# Altium schematic sheet SH6 - PCIe ETHERNET.SchDoc: Jetson AGX Xavier Carrier Board - Ethernet
size B; Engineer: Cindy Li, Chealsie Bains; Organization: UW Robotics; Address1: 200 University Avenue; Address2: Waterloo; Address3: Ontario; Address4: Canada N2L 3G6; DocumentNumber: 6; Revision: 1; SheetNumber: 6; SheetTotal: 12
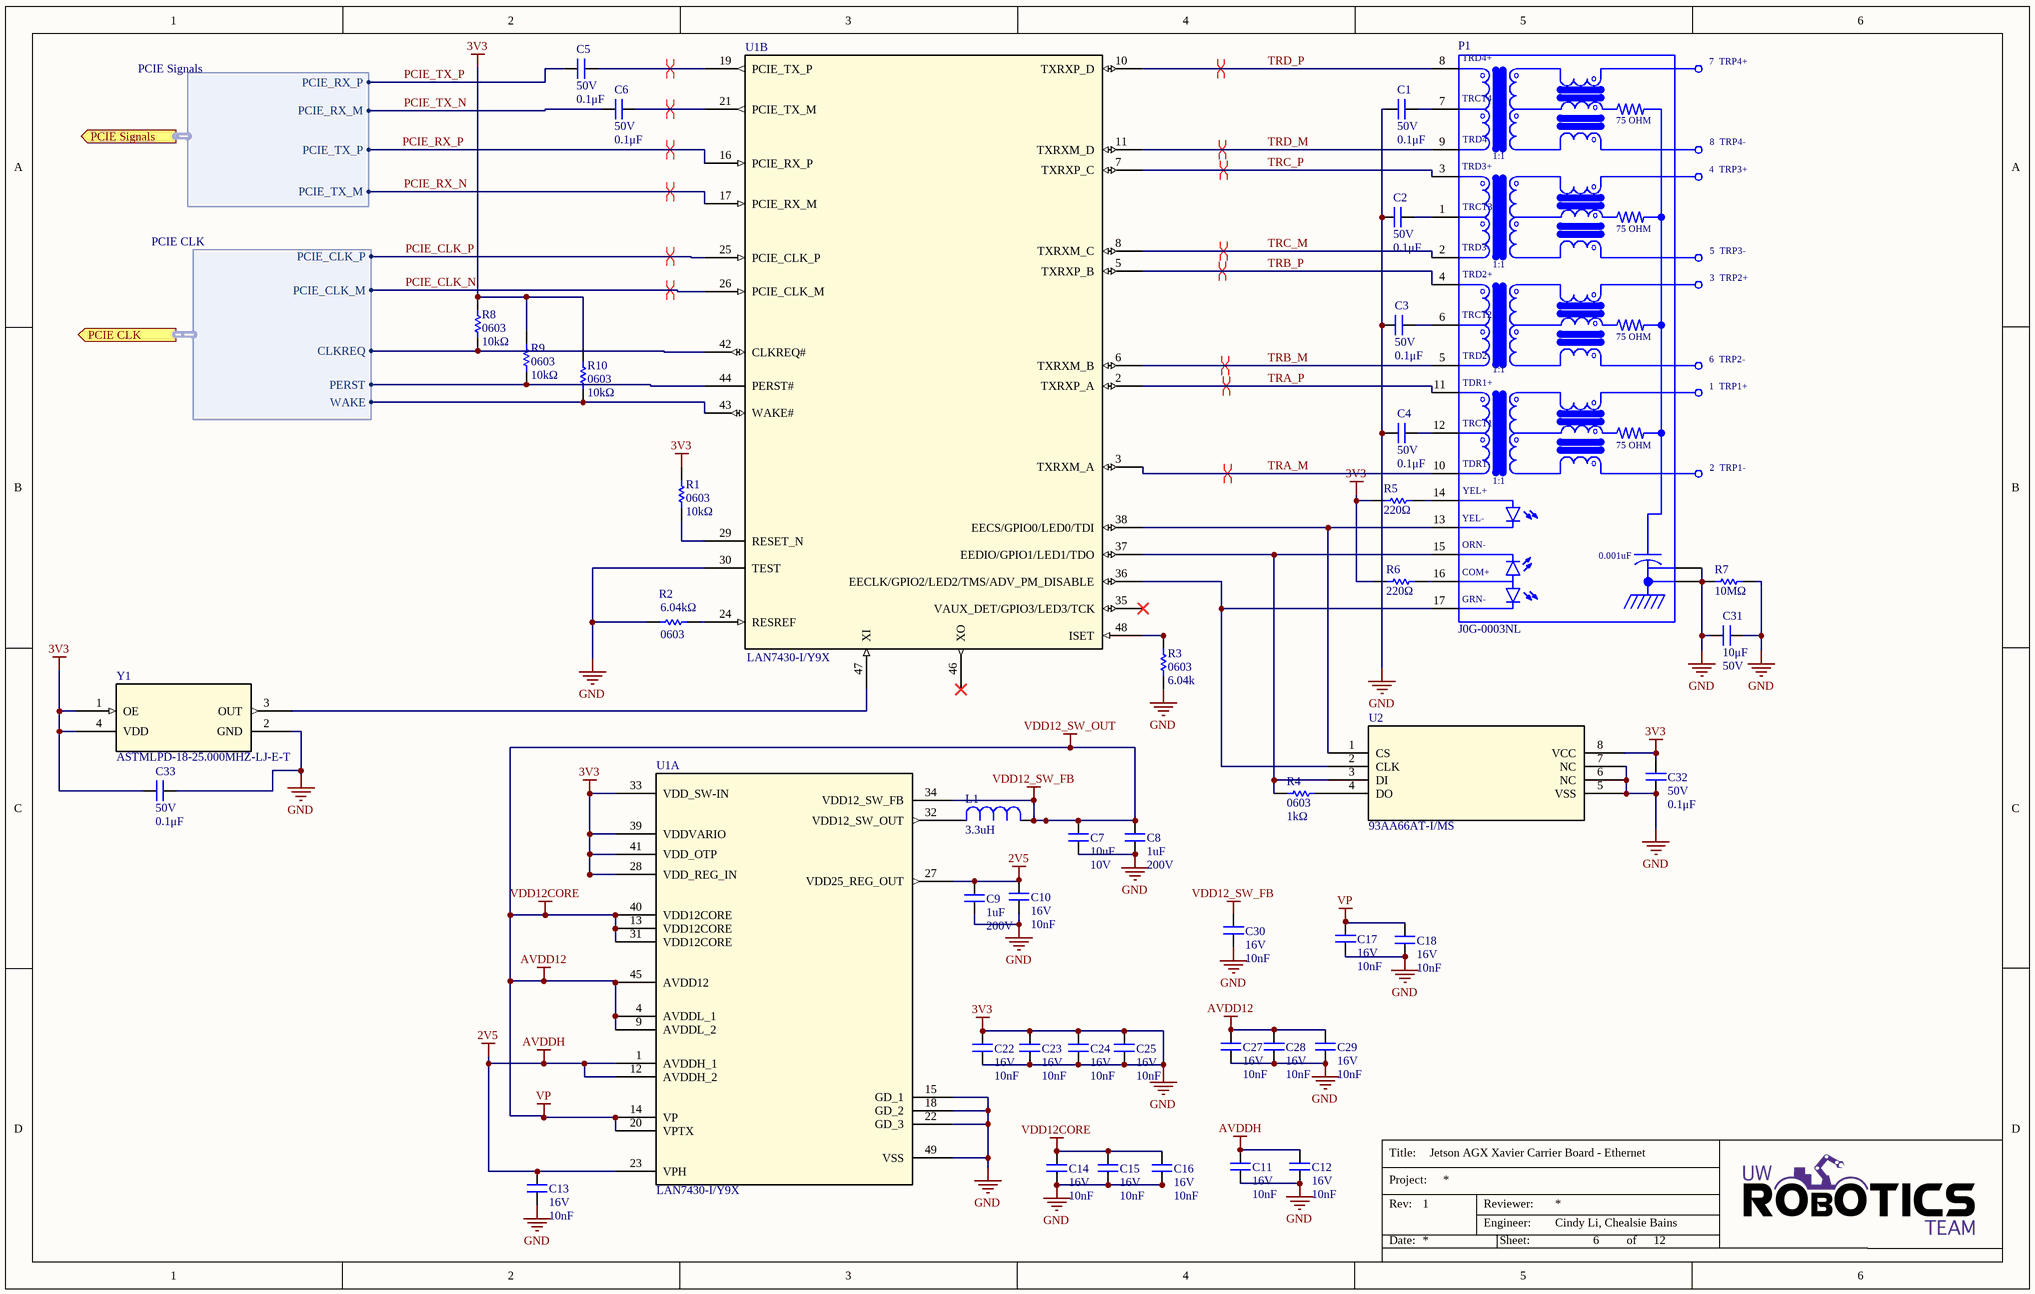
[diagram p0: SH6 - PCIe ETHERNET.SchDoc]

## Parts
C1  value 0.1μF  Voltage Rating: 50V  [CAP0603]  (hidden comment: CAP_0.1uF_50V_0603)
C2  value 0.1μF  Voltage Rating: 50V  [CAP0603]  (hidden comment: CAP_0.1uF_50V_0603)
C3  value 0.1μF  Voltage Rating: 50V  [CAP0603]  (hidden comment: CAP_0.1uF_50V_0603)
C4  value 0.1μF  Voltage Rating: 50V  [CAP0603]  (hidden comment: CAP_0.1uF_50V_0603)
C5  value 0.1μF  Voltage Rating: 50V  [CAP0603]  (hidden comment: CAP_0.1uF_50V_0603)
C6  value 0.1μF  Voltage Rating: 50V  [CAP0603]  (hidden comment: CAP_0.1uF_50V_0603)
C7  value 10uF  Voltage: 10V  (hidden comment: CAP CER 10UF 10V X6S 0805)
C8  value 1uF  Voltage Rating: 200V  [CAP_CER_10000PF]  (hidden comment: CAP_1uF_200V_0603)
C9  value 1uF  Voltage Rating: 200V  [CAP_CER_10000PF]  (hidden comment: CAP_1uF_200V_0603)
C10  value 10nF  Voltage Rating: 16V  [CAP2012]  (hidden comment: CAP_10nF_16V_0805)
C11  value 10nF  Voltage Rating: 16V  [CAP2012]  (hidden comment: CAP_10nF_16V_0805)
C12  value 10nF  Voltage Rating: 16V  [CAP2012]  (hidden comment: CAP_10nF_16V_0805)
C13  value 10nF  Voltage Rating: 16V  [CAP2012]  (hidden comment: CAP_10nF_16V_0805)
C14  value 10nF  Voltage Rating: 16V  [CAP2012]  (hidden comment: CAP_10nF_16V_0805)
C15  value 10nF  Voltage Rating: 16V  [CAP2012]  (hidden comment: CAP_10nF_16V_0805)
C16  value 10nF  Voltage Rating: 16V  [CAP2012]  (hidden comment: CAP_10nF_16V_0805)
C17  value 10nF  Voltage Rating: 16V  [CAP2012]  (hidden comment: CAP_10nF_16V_0805)
C18  value 10nF  Voltage Rating: 16V  [CAP2012]  (hidden comment: CAP_10nF_16V_0805)
C22  value 10nF  Voltage Rating: 16V  [CAP2012]  (hidden comment: CAP_10nF_16V_0805)
C23  value 10nF  Voltage Rating: 16V  [CAP2012]  (hidden comment: CAP_10nF_16V_0805)
C24  value 10nF  Voltage Rating: 16V  [CAP2012]  (hidden comment: CAP_10nF_16V_0805)
C25  value 10nF  Voltage Rating: 16V  [CAP2012]  (hidden comment: CAP_10nF_16V_0805)
C27  value 10nF  Voltage Rating: 16V  [CAP2012]  (hidden comment: CAP_10nF_16V_0805)
C28  value 10nF  Voltage Rating: 16V  [CAP2012]  (hidden comment: CAP_10nF_16V_0805)
C29  value 10nF  Voltage Rating: 16V  [CAP2012]  (hidden comment: CAP_10nF_16V_0805)
C30  value 10nF  Voltage Rating: 16V  [CAP2012]  (hidden comment: CAP_10nF_16V_0805)
C31  value 10μF  Voltage Rating: 50V  [CAP1206]  (hidden comment: CAP_10uF_50V_1206)
C32  value 0.1μF  Voltage Rating: 50V  [CAP0603]  (hidden comment: CAP_0.1uF_50V_0603)
C33  value 0.1μF  Voltage Rating: 50V  [CAP0603]  (hidden comment: CAP_0.1uF_50V_0603)
L1  Inductance: 3.3uH  [IND_BOURNS_SRN6045]  (hidden comment: IND_3.3uH)
P1  J0G-0003NL  [PULSE_J0G-0003NL]
R1  value 10kΩ  Package/Footprint: 0603  [RESC0603]  (hidden comment: RES_10kΩ_0603_5%)
R2  (no value)  [RESC1608X55N]
R3  value 6.04k  Package/Footprint: 0603  [RES0603]  (hidden comment: RES_6.04kΩ_0603_1%)
R4  value 1kΩ  Package/Footprint: 0603  [RESC0603]  (hidden comment: RES_1kΩ_0603_5%)
R5  value 220Ω  [RESC0603]  (hidden comment: RES_220Ω_0603)
R6  value 220Ω  [RESC0603]  (hidden comment: RES_220Ω_0603)
R7  value 10MΩ  [RES0603]  (hidden comment: RES_10MΩ_0603)
R8  value 10kΩ  Package/Footprint: 0603  [RES0603]  (hidden comment: RES_10kΩ_0603_5%)
R9  value 10kΩ  Package/Footprint: 0603  [RES0603]  (hidden comment: RES_10kΩ_0603_5%)
R10  value 10kΩ  Package/Footprint: 0603  [RES0603]  (hidden comment: RES_10kΩ_0603_5%)
U1  LAN7430-I/Y9X  [SQFN48_MCH]  (parts A,B of 2)
U2  93AA66AT-I/MS  [MSOP8_MC_MCH]
Y1  ASTMLPD-18-25.000MHZ-LJ-E-T  [ASTMLPE_ABR]

## Ports
PCIE CLK (out, harness PCIE CLK), PCIE Signals (out, harness PCIE Signals)

## Harnesses
PCIE Signals: PCIE_RX_P, PCIE_RX_M, PCIE_TX_P, PCIE_TX_M
PCIE CLK: PCIE_CLK_P, PCIE_CLK_M, CLKREQ, PERST, WAKE

## Nets
2V5: C9.2 C10.2 C11.2 C12.2 C13.2 U1.1(AVDDH_1) U1.12(AVDDH_2) U1.23(VPH) U1.27(VDD25_REG_OUT)  [also labelled AVDDH]
3V3: C1.1 C2.1 C3.1 C4.1 C7.1 C8.1 C9.1 C10.1 C11.1 C12.1 C13.1 C14.1 C15.1 C16.1 C17.1 C18.1 C22.1 C22.2 C23.1 C23.2 C24.1 C24.2 C25.1 C25.2 C27.1 C28.1 C29.1 C30.1 C31.1 C31.2 C32.1 C32.2 C33.1 C33.2 P1.SH1(SHIELD) P1.SH2(SHIELD) R1.2 R2.1 R3.2 R5.1 R6.1 R7.1 R7.2 R8.2 R9.2 R10.2 U1.15(GD_1) U1.18(GD_2) U1.22(GD_3) U1.28(VDD_REG_IN) U1.30(TEST) U1.33(VDD_SW-IN) U1.39(VDDVARIO) U1.41(VDD_OTP) U1.49(VSS) U2.5(VSS) U2.6(NC) U2.7(NC) U2.8(VCC) Y1.1(OE) Y1.2(GND) Y1.4(VDD)  [also labelled GND]
AVDD12: C7.2 C8.2 C14.2 C15.2 C16.2 C17.2 C18.2 C27.2 C28.2 C29.2 L1.1 U1.4(AVDDL_1) U1.9(AVDDL_2) U1.13(VDD12CORE) U1.14(VP) U1.20(VPTX) U1.31(VDD12CORE) U1.34(VDD12_SW_FB) U1.40(VDD12CORE) U1.45(AVDD12)  [also labelled VDD12_SW_FB, VDD12_SW_OUT, VDD12CORE, VP]
PCIE_CLK_N: U1.26(PCIE_CLK_M) ; port PCIE CLK.PCIE_CLK_M
PCIE_CLK_P: U1.25(PCIE_CLK_P) ; port PCIE CLK.PCIE_CLK_P
PCIE_RX_N: U1.17(PCIE_RX_M) ; port PCIE Signals.PCIE_TX_M
PCIE_RX_P: U1.16(PCIE_RX_P) ; port PCIE Signals.PCIE_TX_P
PCIE_TX_N: C6.1 ; port PCIE Signals.PCIE_RX_M
PCIE_TX_P: C5.1 ; port PCIE Signals.PCIE_RX_P
TRA_M: P1.10(TDR1-) U1.3(TXRXM_A)
TRA_P: P1.11(TDR1+) U1.2(TXRXP_A)
TRB_M: P1.5(TRD2-) U1.6(TXRXM_B)
TRB_P: P1.4(TRD2+) U1.5(TXRXP_B)
TRC_M: P1.2(TRD3-) U1.8(TXRXM_C)
TRC_P: P1.3(TRD3+) U1.7(TXRXP_C)
TRD_M: P1.9(TRD4-) U1.11(TXRXM_D)
TRD_P: P1.8(TRD4+) U1.10(TXRXP_D)
NetC1_2: C1.2 P1.7(TRCT4)
NetC2_2: C2.2 P1.1(TRCT3)
NetC3_2: C3.2 P1.6(TRCT2)
NetC4_2: C4.2 P1.12(TRCT1)
NetC5_2: C5.2 U1.19(PCIE_TX_P)
NetC6_2: C6.2 U1.21(PCIE_TX_M)
NetL1_2: L1.2 U1.32(VDD12_SW_OUT)
NetP1_13: P1.13(YEL-) U1.38(EECS/GPIO0/LED0/TDI) U2.1(CS)
NetP1_14: P1.14(YEL+) R5.2
NetP1_15: P1.15(ORN-) R4.1 U1.37(EEDIO/GPIO1/LED1/TDO) U2.3(DI)
NetP1_16: P1.16(COM+) R6.2
NetP1_17: P1.17(GRN-) U1.36(EECLK/GPIO2/LED2/TMS/ADV_PM_DISABLE) U2.2(CLK)
NetR1_1: R1.1 U1.29(RESET_N)
NetR2_2: R2.2 U1.24(RESREF)
NetR3_1: R3.1 U1.48(ISET)
NetR4_2: R4.2 U2.4(DO)
NetR8_1: R8.1 U1.42(CLKREQ#) ; port PCIE CLK.CLKREQ
NetR9_1: R9.1 U1.44(PERST#) ; port PCIE CLK.PERST
NetR10_1: R10.1 U1.43(WAKE#) ; port PCIE CLK.WAKE
NetU1_47: U1.47(XI) Y1.3(OUT)

Not connected (* = marked no-connect by the designer): C30 2; U1 35(VAUX_DET/GPIO3/LED3/TCK)* 46(XO)*

## Layout directives
differential pair: NetC5_2, NetC6_2, PCIE_CLK_N, PCIE_CLK_P, PCIE_RX_N, PCIE_RX_P, TRA_M, TRA_P, TRB_M, TRB_P, TRC_M, TRC_P, TRD_M, TRD_P

## Notes on the sheet
- Labels drawn without touching a wire or pin: VDD12_SW_FB
- Title:
- Project:
- Date:
- Rev:
- Reviewer:
- Engineer:
- Sheet:
- of
- (in symbol J0G-0003NL) 7  TRP4+; 75 OHM; 8  TRP4-; 1:1; 4  TRP3+; 5  TRP3-; 3  TRP2+; 6  TRP2-; 1  TRP1+; 2  TRP1-; 0.001uF
- (in symbol RES_200Ω) 6.04kΩ; 0603

## Library data of the parts
C1-C6 C32 C33 = CAP_0.1uF_50V_0603: CAP CER 0.1UF 50V X7R 0603; Manufacturer Part Number 1: CC0603KRX7R9BB104; Manufacturer 1: Yageo; Package/Footprint: 0603; Supplier Part Number 1: 311-1344-1-ND; Supplier 1: Digi-Key; Mounting Type: SMD; Dielectric: X7R
C7 = CAP CER 10UF 10V X6S 0805: Ceramic Capacitor, Multilayer, Ceramic, 10V, 20% +Tol, 20% -Tol, X6S, 22% TC, 10uF, Surface Mount, 0805; Manufacturer: Taiyo Yuden; Manufacturer Part Number: LMK212AC6106MD-T; Supplier 1: Digi-Key; Supplier Part Number 1: 587-6337-1-ND; RoHS: Yes; Stock 1: 703; Pricing 1: 1=0.29000, 10=0.20100, 50=0.12060, 100=0.10180, 500=0.06966, 1000=0.06163 (USD); ComponentLink1URL: https://datasheet.ciiva.com:443/pdfs/VipMasterIC/IC/TAIY/TAIY-S-A0009099504/TAIY-S-A0009099407-1.pdf?src-supplier=IHS+Markit; ComponentLink1Description: https://datasheet.ciiva.com:443/pdfs/VipMasterIC/IC/TAIY/TAIY-S-A0009099504/TAIY-S-A0009099407-1.pdf?src-supplier=IHS+Markit; ComponentLink2URL: https://ds.yuden.co.jp/TYCOMPAS/ut/detail?pn=LMK212AC6106MD-T &amp;u=M&src-supplier=Digi-Key; ComponentLink2Description: https://ds.yuden.co.jp/TYCOMPAS/ut/detail?pn=LMK212AC6106MD-T &amp;u=M&src-supplier=Digi-Key
C8 C9 = CAP_1uF_200V_0603: Ceramic Capacitor, Multilayer, Ceramic, 35V, 20% +Tol, 20% -Tol, X5R, 15% TC, 1uF, Surface Mount, 0603; Manufacturer 1: KEMET; Manufacturer Part Number 1: C0603C103K2REC7867; Manufacturer: Taiyo Yuden; Manufacturer Part Number: GMK107BJ105MAHT; Dielectric: X7R; Multilayer: Yes; Reference Standard: AEC-Q200; Supplier 1: Digi-Key; Supplier Part Number 1: 399-14173-1-ND; Supplier 2: Digi-Key; Supplier Part Number 2: 587-6315-1-ND; RoHS: Yes; Category: Ceramic Capacitors; Stock 2: 1753; Pricing 2: 1=0.19000, 10=0.13300, 50=0.07960, 100=0.06730, 500=0.04604, 1000=0.04073 (USD); Mount: Surface Mount; Number of Pins: 2; Dielectric Material: Ceramic; Package Shape: Rectangular; Size Code: 0603; Min Operating Temperature: -55°C; Max Operating Temperature: 85°C; Capacitance: 1uF; Capacitor Type: Ceramic; Negative Tolerance: 20%; Package Style: SMTMeter; Packaging: Tape and Reel; Positive Tolerance: 20%; Rated DC Voltage (URdc): 35V; Temperature Characteristics Code: X5R; Termination: Wraparound; Length: 1.6mm; Width: 0.8mm; Height: 0.8mm; REACH SVHC: Yes; RoHS Compliant: Yes; ComponentLink1URL: https://datasheet.ciiva.com:443/pdfs/VipMasterIC/IC/TAIY/TAIY-S-A0009096450/TAIY-S-A0009097130-1.pdf?src-supplier=IHS+Markit; ComponentLink1Description: https://datasheet.ciiva.com:443/pdfs/VipMasterIC/IC/TAIY/TAIY-S-A0009096450/TAIY-S-A0009097130-1.pdf?src-supplier=IHS+Markit; ComponentLink2URL: http://ds.yuden.co.jp/TYCOMPAS/ut/detail.do?productNo=GMK107BJ105MAHT&amp;fileName=GMK107BJ105MAHT_SS&amp;mode=specSheetDownload&src-supplier=Digi-Key; ComponentLink2Description: http://ds.yuden.co.jp/TYCOMPAS/ut/detail.do?productNo=GMK107BJ105MAHT&amp;fileName=GMK107BJ105MAHT_SS&amp;mode=specSheetDownload&src-supplier=Digi-Key
C10-C18 C22-C25 C27-C30 = CAP_10nF_16V_0805: CAP CER 10000PF 16V X7R 0805; Manufacturer 1: Yageo; Manufacturer Part Number 1: AC0805KRX7R7BB103; Supplier 1: Digi-Key; Supplier Part Number 1: 311-3161-1-ND
C31 = CAP_10uF_50V_1206: CAP CER 10UF 50V X5R 1206; Manufacturer 1: Murata; Manufacturer Part Number 1: GRT31CR61H106KE01L; Package/Footprint: 1206; Supplier Part Number 1: 490-12456-1-ND; Supplier 1: Digi-Key; Mounting Type: SMD; Dielectric: X5R
L1 = IND_3.3uH: FIXED INDUCTOR 3.3UH SMD; Manufacturer 1: KEMET; Manufacturer Part Number 1: L0603B3R3MDWFT; Test Frequency: 100kHz; DC Current: 1.9A; Inductance Tolerance: 20%; Shielding: Shielded; Saturation Current: 2.3A; Self Resonant Frequency: 13MHz; Supplier 1: Digi-Key; Number of Pins: 2; Composition: Wirewound; Military Standard: Not; RMS Current (Irms): 1.9A; Current Rating: 1.9A; ComponentLink7URL: https://datasheet.ciiva.com/4954/srn6045-70649-4954231.pdf?src-supplier=Mouser; ComponentLink7Description: https://datasheet.ciiva.com/4954/srn6045-70649-4954231.pdf?src-supplier=Mouser; ComponentLink8URL: https://datasheet.ciiva.com/1056/srn6045-1056106.pdf?src-supplier=Digi-Key; ComponentLink8Description: https://datasheet.ciiva.com/1056/srn6045-1056106.pdf?src-supplier=Digi-Key; ComponentLink9URL: https://datasheet.ciiva.com/1056/srn6045-1056108.pdf?src-supplier=Digi-Key; ComponentLink9Description: https://datasheet.ciiva.com/1056/srn6045-1056108.pdf?src-supplier=Digi-Key; Supplier Part Number 1: SRN6045-150MCT-ND
P1 = J0G-0003NL: 1 Port RJ45 Magjack Connector Through Hole 10/100/1000 Base-T, AutoMDIX; MF: Pulse Electronics; Digi-Key_Part_Number: 553-1852-ND; Package: Custom Package Pulse Electronics Network; MP: J0G-0003NL; SnapEDA_Link: https://www.snapeda.com/parts/J0G-0003NL/Pulse%20Electronics%20Network/view-part/368728/?ref=snap; Digi-Key_Purchase_URL: https://www.digikey.com/product-detail/en/pulse-electronics-network/J0G-0003NL/553-1852-ND/2264761?utm_source=snapeda&utm_medium=aggregator&utm_campaign=symbol; Value: *
R1 R8-R10 = RES_10kΩ_0603_5%: RES 10K OHM 5% 1/10W 0603; Manufacturer 1: Yageo; Manufacturer Part Number 1: RC0603JR-0710KL; Supplier Part Number 1: 311-10KGRCT-ND; Supplier 1: Digi-Key; Mounting Type: SMD
R2 = RES_200Ω: RES 0603 200 OHM 1/10W 1% SMD; MP: SFR03EZPF2000; Package: None; Price: None; Value: *; Availability: Unavailable
R3 = RES_6.04kΩ_0603_1%: RES 6.04K OHM 1% 1/10W 0603; Manufacturer 1: Stackpole Electronics Inc; Manufacturer Part Number 1: RMCF0603FT6R04; Supplier 1: Digi-Key; Supplier Part Number 1: Stackpole Electronics Inc; Mounting Type: SMD
R4 = RES_1kΩ_0603_5%: RES 1K OHM 5% 1/10W 0603; Manufacturer 1: Yageo; Manufacturer Part Number 1: RC0603JR-071KL; Supplier Part Number 1: 311-1.0KGRCT-ND; Supplier 1: Digi-Key; Mounting Type: SMD
R5 R6 = RES_220Ω_0603_5%: RES 220 OHM 5% 1/10W 0603; Manufacturer 1: Yageo; Manufacturer Part Number 1: AC0603JR-07220RL; Supplier Part Number 1: YAG3652CT-ND; Supplier 1: Digi-Key
R7 = RES_10MΩ_0603_5%: RES 10M OHM 5% 1/10W 0603; Manufacturer 1: Vishay Dale; Manufacturer Part Number 1: CRCW060310M0JNEA; Supplier Part Number 1: 541-10MGCT-ND; Supplier 1: Digi-Key
U1 = LAN7430-I/Y9X: Vendor: Microchip; Built_By: EMA_Cory; SourceLibrary: Microchip_2020-04-01; Datasheet: http://ww1.microchip.com/downloads/en/DeviceDoc/LAN7430-LAN7431-Data%20Sheet-DS00002631B.pdf; Manufacturer_Part_Number: LAN7430-I/Y9X; Copyright: Copyright (C) 2018 Accelerated Designs. All rights reserved; RefDes: RefDes; Type: DEV
U2 = 93AA66AT-I/MS: No Description Available; Vendor: Microchip; Built_By: EMA_UL_Team; SourceLibrary: Microchip_2014-06-20; Manufacturer_Part_Number: 93AA66AT-I/MS; Copyright: Copyright (C) 2018 Accelerated Designs. All rights reserved; RefDes: RefDes; Type: DEV
Y1 = ASTMLPD-18-25.000MHZ-LJ-E-T: Oscillator; Vendor: Abracon; Built_By: EMA_Cory; Datasheet: https://abracon.com/Oscillators/ASTMLP.pdf; Manufacturer_Part_Number: ASTMLPD-18-25.000MHZ-LJ-E-T; Type: DEV